# Altium schematic sheet Monster_Tile.SchDoc
size D; SheetNumber: 1; SheetTotal: 1
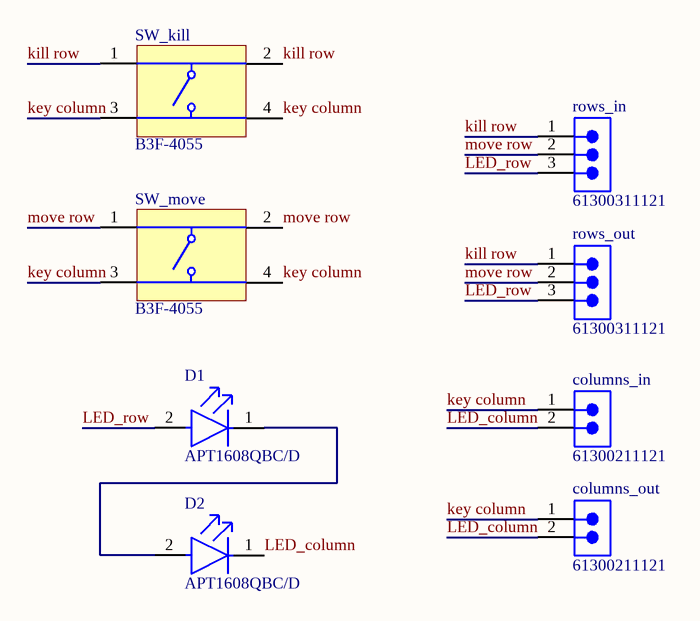
[diagram p0: Monster_Tile.SchDoc]

## Parts
columns_in  61300211121  [61300211121]
columns_out  61300211121  [61300211121]
D1  APT1608QBC/D  [FP-APT1608QBC-D-MFG]
D2  APT1608QBC/D  [FP-APT1608QBC-D-MFG]
rows_in  61300311121  [61300311121]
rows_out  61300311121  [61300311121]
SW_kill  B3F-4055  [OMRON-B3F-4055_V]
SW_move  B3F-4055  [OMRON-B3F-4055_V]

## Nets
key column: columns_in.1 columns_out.1 SW_kill.3 SW_kill.4 SW_move.3 SW_move.4
kill row: rows_in.1 rows_out.1 SW_kill.1 SW_kill.2
LED_column: columns_in.2 columns_out.2 D2.1(C)
LED_row: D1.2(A) rows_in.3 rows_out.3
move row: rows_in.2 rows_out.2 SW_move.1 SW_move.2
NetD1_1: D1.1(C) D2.2(A)

## Library data of the parts
columns_in columns_out = CMP-1712-00002-5: NexarPartId: 20081794; Operating Supply Voltage: 250V; Current Rating: 3A; Gender: Male; Number of Contacts: 2; Pitch: 2.54mm; Connector Type: Male Pin; Contact Resistance: 20mΩ; Contact Plating: Gold; Contact Material: Copper; Number of Pins: 2; Min Operating Temperature: -40°C; Packaging: Bulk; Lead Pitch: 2.54mm; Mount: Through Hole; Orientation: Vertical; RoHS: Compliant; REACH SVHC: No SVHC; Height: 8.94mm; Termination: Through Hole; Number of Positions: 2; Contact Mating Length: 5.9944mm; Color: Black; Contact Gender: Male; Number of Rows: 1; Housing Material: PBT; Lead Free: Lead Free; Voltage Rating: 250V; Max Operating Temperature: 125°C
D1 D2 = CMP-2000-05788-2: LED BLUE CLEAR CHIP SMD; Lens Style: Flat; Forward Current: 20mA; Luminous Intensity: 100mcd; Number of LEDs: 1; Dominant Wavelength: 465nm; Lens Color: Colorless; Forward Voltage: 3.3V; Viewing Angle: 120°; Case Code (Imperial): 0603; Number of Pins: 2; Length: 1.6mm; Mount: Surface Mount; Color: Blue; Width: 0.8mm; Height: 0.75mm; Case/Package: 0603; Lead Free: Lead Free; Case Code (Metric): 1608; Lens Transparency: Clear; Min Operating Temperature: -40°C; Packaging: Tape and Reel; Max Operating Temperature: 85°C; Package Quantity: 2000; Test Current: 20mA; Illumination Color: Blue
rows_in rows_out = CMP-1502-01062-2: NexarPartId: 32855521; Voltage Rating: 250V; Current Rating: 3A; Connector Type: Male Pin; Number of Positions: 3; Gender: Male; Contact Resistance: 20mΩ; Pitch: 2.54mm; Max Operating Temperature: 105°C; Lead Pitch: 2.54mm; Lead Free: Lead Free; Contact Mating Length: 5.9944mm; Contact Material: Copper; Number of Pins: 3; Orientation: Vertical; Height: 8.94mm; Packaging: Bulk; Min Operating Temperature: -40°C; Mount: Through Hole; RoHS: Compliant; Number of Contacts: 3; Operating Supply Voltage: 250V; Termination: Solder; Number of Rows: 1; Contact Plating: Gold; Color: Black; REACH SVHC: Unknown
SW_kill SW_move = CMP-2000-05902-1: Tactile Switch, 1 to 50 mA, 100 mOhm Max, 5 to 24 VDC, -25 to 70 degC, 4-Pin THD, RoHS, Bulk; Manufacturer: OmronElectronics; Contact Rating @ Voltage: 0.05@24VDCA; Pole Throw Configuration: SPST; Dielectric Strength: 500VAC; Maximum DC Voltage Rating: 24V; Electrical Life: 1000000Cycles; Product Weight: 0.85g; Switch Configuration: N.O.; Actuator Style: ProjectedPlunger; Actuator Color: Orange; Actuator Length: 3mm; Illumination Type: N/R; Body Orientation: Straight; Operating Force: 2.55N; Ground Terminal: No; Datasheet URL: https://datasheet.ciiva.com/20148/78-0136-20148640.pdf; Seal Location: N/A; Mechanical Life: N/A; Operating Temperature: -25to70C; Maximum AC Voltage Rating: N/A; Dimension: 12x12x7.3mm; Minimum Insulation Resistance: 100MOhm; Mounting: ThroughHole,PCPins; Housing Material: N/A; Packaging: Bag; Part No: B3F-4055; Maximum Contact Resistance: 100mOhm; Base Material: N/A; Manufacturer URL: http://www.omron.com/; RoHS: Yes; Contact Material: N/A; Package Description: 4-Pin Through Hole Device, Body 12 x 12 mm; Family: B3F; Mounting Technology: ThroughHole; Package Reference: B3F-4055; Contact Plating: Gold; Seal Description: N/A; Type: Miniature; Datasheet Version: 06/2009